# Altium schematic sheet cSLIM-SA_RTC.SchDoc: cSLIM v1 - RTC
size A4; SheetNumber: 12; SheetTotal: 12
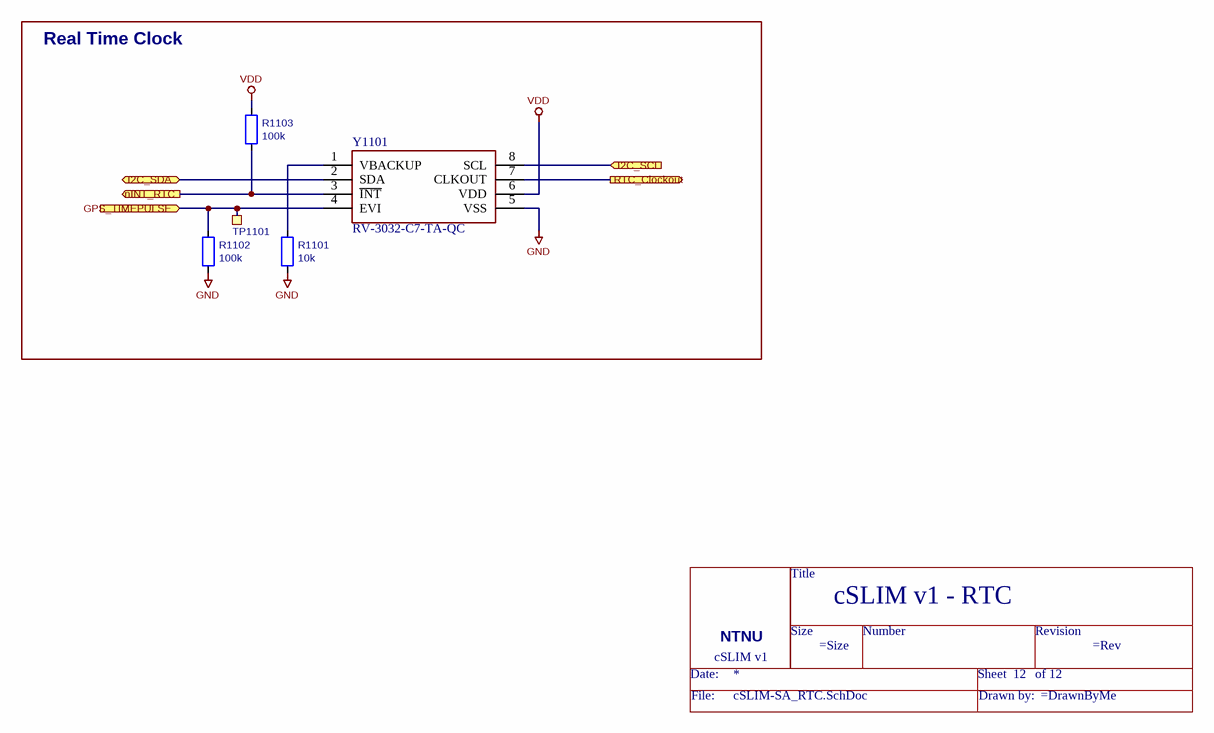
[diagram p0: cSLIM-SA_RTC.SchDoc]

## Parts
=DocumentName  Title_block  (value not drawn)  (no BOM)
R1101  10k  [RESC1608X55N]
R1102  100k  [RESC1608X55N]
R1103  100k  [RESC1608X55N]
TP1101  (no value)  [TP_SMD_Ø1.0mm]  (no BOM)
Y1101  RV-3032-C7-TA-QC  [RV3032C7TAQA]

## Blocks framed on the sheet
Real Time Clock: R1101-R1103 TP1101 Y1101

## Ports
GPS_TIMEPULSE (in), I2C_SCL (in), I2C_SDA (bidir), nINT_RTC (out), RTC_Clockout (out)

## Nets
GND: R1101.2 R1102.1 Y1101.5(VSS)
VDD: R1103.2 Y1101.6(VDD)
GPS_TIMEPULSE: R1102.2 TP1101.1 Y1101.4(EVI) ; port GPS_TIMEPULSE
I2C_SCL: Y1101.8(SCL) ; port I2C_SCL
I2C_SDA: Y1101.2(SDA) ; port I2C_SDA
nINT_RTC: R1103.1 Y1101.3(~{INT}) ; port nINT_RTC
RTC_Clockout: Y1101.7(CLKOUT) ; port RTC_Clockout
NetR1101_1: R1101.1 Y1101.1(VBACKUP)

## Notes on the sheet
- 1
- 2
- 3
- 4
- 5
- 6
- A
- B
- C
- Eivind Jølsgard
- D
- Title: cSLIM RTC
- File: cSLIM_RTC.sch
- Sheet: /
- NTNU
- KiCad E.D.A.  kicad (5.1.4)-1
- Size: A4
- Date: 2021-03-31
- Rev: v1
- Id: 11/11
- (in symbol Title_block) Title; Size; Number; Revision; NTNU; cSLIM v1; Date:; Sheet; of; File:; Drawn by:

## Library data of the parts
R1101-R1103 = R
  R1101: Value: 10k
  R1102 R1103: Value: 100k
TP1101 = TP
Y1101 = RV-3032-C7-TA-QC: Integrated Circuit; Manufacturer_Name: Micro Crystal AG; Datasheet Link: https://www.microcrystal.com/fileadmin/Media/Products/RTC/Datasheet/RV-3032-C7.pdf; Height: 0.8mm; Manufacturer_Part_Number: RV-3032-C7-TA-QC